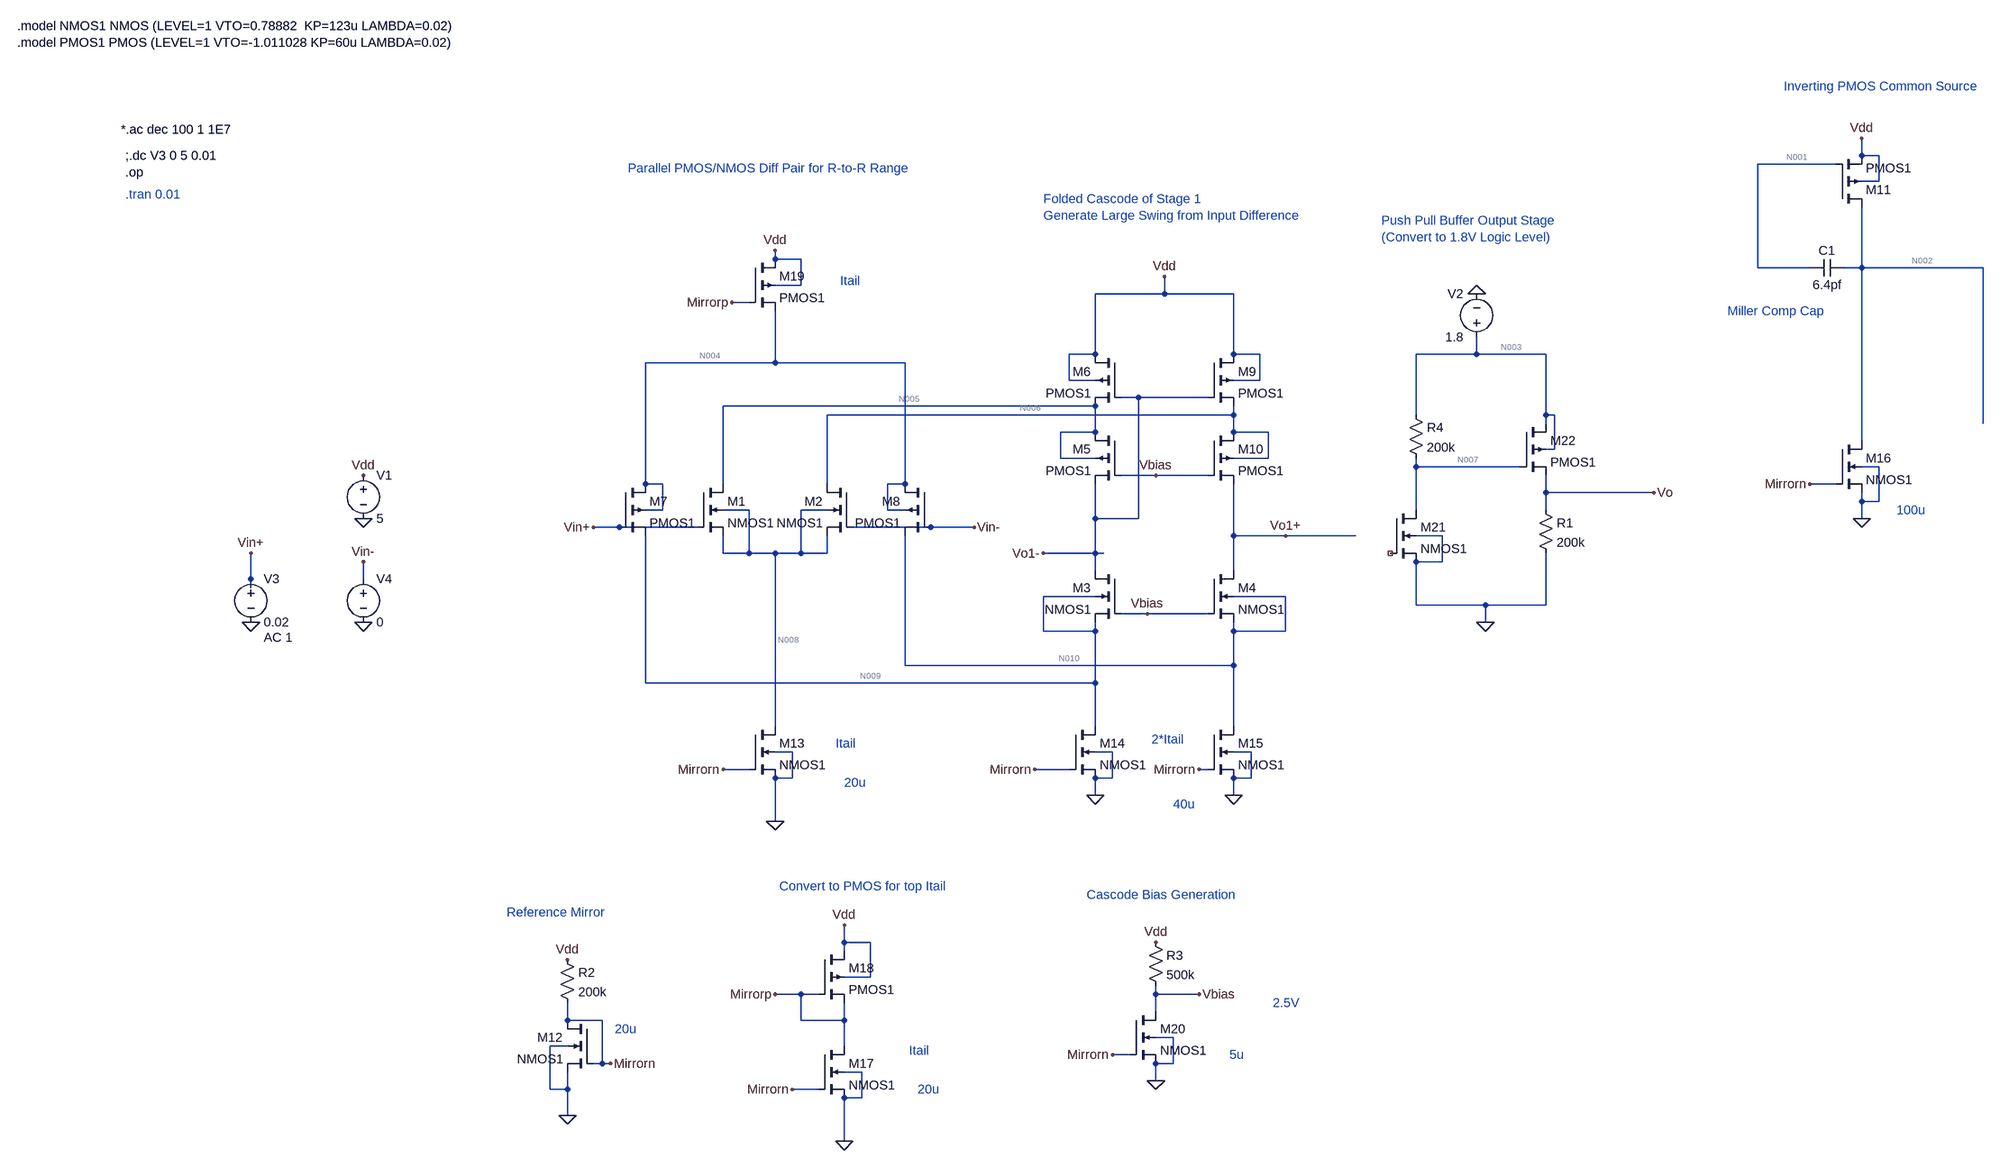
[diagram p0: schematic MOSFET_R2R_Input_Stage_CS_output_tuned_nolevelshift_WyattBuffer.asc]
MOSFET_R2R_Input_Stage_CS_output_tuned_nolevelshift_WyattBuffer.asc, the LTspice schematic file:
Version 4.1
SHEET 1 3376 1972
WIRE 3120 -32 3120 -64
WIRE 3152 -32 3120 -32
WIRE 3072 -16 2928 -16
WIRE 3152 16 3152 -32
WIRE 3152 16 3120 16
WIRE -96 160 -96 144
WIRE -48 160 -96 160
WIRE 2928 176 2928 -16
WIRE 3024 176 2928 176
WIRE 3120 176 3120 64
WIRE 3120 176 3088 176
WIRE 3344 176 3120 176
WIRE -48 208 -48 160
WIRE -48 208 -96 208
WIRE 624 224 624 192
WIRE 624 224 496 224
WIRE 752 224 624 224
WIRE -144 240 -176 240
WIRE 496 336 496 224
WIRE 496 336 448 336
WIRE 752 336 752 224
WIRE 800 336 752 336
WIRE 1328 336 1328 304
WIRE 1328 336 1216 336
WIRE 1456 336 1328 336
WIRE -96 352 -96 256
WIRE -96 352 -336 352
WIRE 144 352 -96 352
WIRE 448 384 448 336
WIRE 496 384 448 384
WIRE 800 384 800 336
WIRE 800 384 752 384
WIRE 576 416 544 416
WIRE 704 416 576 416
WIRE 496 432 -192 432
WIRE 752 448 752 432
WIRE 752 448 0 448
WIRE 1216 448 1216 336
WIRE 1456 448 1456 336
WIRE 1472 448 1456 448
WIRE 1456 464 1456 448
WIRE 3344 464 3344 176
WIRE 496 480 496 432
WIRE 496 480 432 480
WIRE 752 480 752 448
WIRE 816 480 752 480
WIRE 3120 496 3120 176
WIRE 1472 512 1472 448
WIRE 1472 512 1456 512
WIRE 432 528 432 480
WIRE 496 528 432 528
WIRE 816 528 816 480
WIRE 816 528 752 528
WIRE 1216 544 1216 528
WIRE 1408 544 1216 544
WIRE 3152 544 3120 544
WIRE 608 560 544 560
WIRE 704 560 608 560
WIRE -336 576 -336 352
WIRE -304 576 -336 576
WIRE -192 576 -192 432
WIRE 0 576 0 448
WIRE 144 576 144 352
WIRE 144 576 112 576
WIRE 3072 576 3024 576
WIRE 1456 592 1456 560
WIRE 1696 592 1456 592
WIRE 3120 608 3120 592
WIRE 3152 608 3152 544
WIRE 3152 608 3120 608
WIRE -304 624 -304 576
WIRE -304 624 -336 624
WIRE -144 624 -192 624
WIRE 0 624 -48 624
WIRE 112 624 112 576
WIRE 144 624 112 624
WIRE 1216 624 1216 544
WIRE 1456 624 1456 592
WIRE 496 640 496 576
WIRE 576 640 576 416
WIRE 576 640 496 640
WIRE 3120 640 3120 608
WIRE -384 656 -432 656
WIRE -240 656 -384 656
WIRE 192 656 48 656
WIRE 272 656 192 656
WIRE 752 672 752 576
WIRE 848 672 752 672
WIRE 1104 672 848 672
WIRE 1264 672 1216 672
WIRE -192 704 -192 672
WIRE -144 704 -144 624
WIRE -144 704 -192 704
WIRE -96 704 -144 704
WIRE -48 704 -48 624
WIRE -48 704 -96 704
WIRE 0 704 0 672
WIRE 0 704 -48 704
WIRE 496 704 496 640
WIRE 496 704 400 704
WIRE 512 704 496 704
WIRE 1264 720 1264 672
WIRE 1264 720 1216 720
WIRE 496 736 496 704
WIRE 752 736 752 672
WIRE -1152 752 -1152 704
WIRE -944 752 -944 720
WIRE -1152 768 -1152 752
WIRE 496 784 400 784
WIRE 848 784 752 784
WIRE 1216 800 1216 720
WIRE 1344 800 1216 800
WIRE 1456 800 1456 704
WIRE 1456 800 1344 800
WIRE 592 816 544 816
WIRE 704 816 592 816
WIRE 1344 832 1344 800
WIRE 400 848 400 784
WIRE 496 848 496 832
WIRE 496 848 400 848
WIRE 752 848 752 832
WIRE 848 848 848 784
WIRE 848 848 752 848
WIRE 144 912 144 672
WIRE 752 912 752 848
WIRE 752 912 144 912
WIRE -336 944 -336 672
WIRE 496 944 496 848
WIRE 496 944 -336 944
WIRE -96 1024 -96 704
WIRE 496 1024 496 944
WIRE 752 1024 752 912
WIRE -64 1072 -96 1072
WIRE 528 1072 496 1072
WIRE 784 1072 752 1072
WIRE -144 1104 -192 1104
WIRE 448 1104 384 1104
WIRE 704 1104 688 1104
WIRE -64 1120 -64 1072
WIRE -64 1120 -96 1120
WIRE 496 1120 496 1104
WIRE 528 1120 528 1072
WIRE 528 1120 496 1120
WIRE 784 1120 784 1072
WIRE 784 1120 752 1120
WIRE 496 1152 496 1120
WIRE 752 1152 752 1120
WIRE -96 1200 -96 1120
WIRE 32 1424 32 1392
WIRE 80 1424 32 1424
WIRE 32 1440 32 1424
WIRE 80 1488 80 1424
WIRE 80 1488 32 1488
WIRE -48 1520 -96 1520
WIRE -16 1520 -48 1520
WIRE 608 1520 608 1504
WIRE 688 1520 608 1520
WIRE 608 1552 608 1520
WIRE -480 1568 -480 1536
WIRE -416 1568 -480 1568
WIRE -48 1568 -48 1520
WIRE 32 1568 32 1536
WIRE 32 1568 -48 1568
WIRE 640 1600 608 1600
WIRE -480 1616 -512 1616
WIRE 32 1616 32 1568
WIRE 560 1632 528 1632
WIRE -416 1648 -416 1568
WIRE -416 1648 -432 1648
WIRE -400 1648 -416 1648
WIRE 640 1648 640 1600
WIRE 640 1648 608 1648
WIRE 64 1664 32 1664
WIRE 608 1680 608 1648
WIRE -512 1696 -512 1616
WIRE -480 1696 -480 1664
WIRE -480 1696 -512 1696
WIRE -16 1696 -64 1696
WIRE 64 1712 64 1664
WIRE 64 1712 32 1712
WIRE -480 1744 -480 1696
WIRE 32 1792 32 1712
FLAG 272 656 Vin-
FLAG -432 656 Vin+
FLAG -944 640 0
FLAG -944 560 Vdd
FLAG -96 144 Vdd
FLAG 496 1152 0
FLAG 752 1152 0
FLAG 624 192 Vdd
FLAG -1152 832 0
FLAG -944 832 0
FLAG -1152 704 Vin+
FLAG -944 720 Vin-
FLAG 3120 -64 Vdd
FLAG 3120 640 0
FLAG 848 672 Vo1+
FLAG 400 704 Vo1-
FLAG -480 1456 Vdd
FLAG -480 1744 0
FLAG -96 1200 0
FLAG -400 1648 Mirrorn
FLAG -192 1104 Mirrorn
FLAG 384 1104 Mirrorn
FLAG 688 1104 Mirrorn
FLAG 3024 576 Mirrorn
FLAG 32 1792 0
FLAG -64 1696 Mirrorn
FLAG 32 1392 Vdd
FLAG -96 1520 Mirrorp
FLAG -176 240 Mirrorp
FLAG 528 1632 Mirrorn
FLAG 608 1680 0
FLAG 608 1424 Vdd
FLAG 688 1520 Vbias
FLAG 592 816 Vbias
FLAG 608 560 Vbias
FLAG 1328 224 0
FLAG 1344 832 0
FLAG 1696 592 Vo
DATAFLAG 992 672 ""
DATAFLAG 416 944 ""
DATAFLAG 656 912 ""
DATAFLAG 512 704 ""
DATAFLAG -272 352 ""
DATAFLAG -96 816 ""
DATAFLAG 2944 -16 ""
DATAFLAG 3232 176 ""
DATAFLAG 1584 592 ""
DATAFLAG 1328 544 ""
DATAFLAG 752 1008 ""
SYMBOL nmos4 -240 576 R0
SYMATTR InstName M1
SYMATTR Value NMOS1
SYMATTR Value2 l=0.5u w=0.5u
SYMBOL nmos4 48 576 M0
SYMATTR InstName M2
SYMATTR Value NMOS1
SYMATTR Value2 l=0.5u w=0.5u
SYMBOL pmos4 -384 576 R0
SYMATTR InstName M7
SYMATTR Value PMOS1
SYMATTR Value2 l=0.5u w=1u
SYMBOL pmos4 192 576 M0
SYMATTR InstName M8
SYMATTR Value PMOS1
SYMATTR Value2 l=0.5u w=1u
SYMBOL voltage -944 544 R0
WINDOW 123 0 0 Left 0
WINDOW 39 0 0 Left 0
SYMATTR InstName V1
SYMATTR Value 5
SYMBOL nmos4 544 736 M0
SYMATTR InstName M3
SYMATTR Value NMOS1
SYMATTR Value2 l=0.5u w=0.5u
SYMBOL nmos4 704 736 R0
SYMATTR InstName M4
SYMATTR Value NMOS1
SYMATTR Value2 l=0.5u w=0.5u
SYMBOL pmos4 544 480 M0
SYMATTR InstName M5
SYMATTR Value PMOS1
SYMATTR Value2 l=0.5u w=1u
SYMBOL pmos4 544 336 M0
SYMATTR InstName M6
SYMATTR Value PMOS1
SYMATTR Value2 l=0.5u w=2u
SYMBOL pmos4 704 336 R0
SYMATTR InstName M9
SYMATTR Value PMOS1
SYMATTR Value2 l=0.5u w=2u
SYMBOL pmos4 704 480 R0
SYMATTR InstName M10
SYMATTR Value PMOS1
SYMATTR Value2 l=0.5u w=1u
SYMBOL voltage -1152 736 R0
WINDOW 123 24 124 Left 2
WINDOW 39 0 0 Left 0
SYMATTR Value2 AC 1
SYMATTR InstName V3
SYMATTR Value 0.02
SYMBOL voltage -944 736 R0
WINDOW 123 0 0 Left 0
WINDOW 39 0 0 Left 0
SYMATTR InstName V4
SYMATTR Value 0
SYMBOL cap 3088 160 R90
WINDOW 0 0 32 VBottom 2
WINDOW 3 32 32 VTop 2
SYMATTR InstName C1
SYMATTR Value 6.4pf
SYMBOL pmos4 3072 64 M180
SYMATTR InstName M11
SYMATTR Value PMOS1
SYMATTR Value2 l=0.5u w=5u
SYMBOL res -496 1440 R0
SYMATTR InstName R2
SYMATTR Value 200k
SYMBOL nmos4 -432 1568 M0
SYMATTR InstName M12
SYMATTR Value NMOS1
SYMATTR Value2 l=0.5u w=4u
SYMBOL nmos4 -144 1024 R0
SYMATTR InstName M13
SYMATTR Value NMOS1
SYMATTR Value2 l=0.5u w=4u
SYMBOL nmos4 448 1024 R0
SYMATTR InstName M14
SYMATTR Value NMOS1
SYMATTR Value2 l=0.5u w=8u
SYMBOL nmos4 704 1024 R0
SYMATTR InstName M15
SYMATTR Value NMOS1
SYMATTR Value2 l=0.5u w=8u
SYMBOL nmos4 3072 496 R0
SYMATTR InstName M16
SYMATTR Value NMOS1
SYMATTR Value2 l=0.5u w=20u
SYMBOL nmos4 -16 1616 R0
SYMATTR InstName M17
SYMATTR Value NMOS1
SYMATTR Value2 l=0.5u w=4u
SYMBOL pmos4 -16 1440 R0
SYMATTR InstName M18
SYMATTR Value PMOS1
SYMATTR Value2 l=0.5u w=4u
SYMBOL pmos4 -144 160 R0
SYMATTR InstName M19
SYMATTR Value PMOS1
SYMATTR Value2 l=0.5u w=4u
SYMBOL nmos4 560 1552 R0
SYMATTR InstName M20
SYMATTR Value NMOS1
SYMATTR Value2 l=0.5u w=1u
SYMBOL res 592 1408 R0
SYMATTR InstName R3
SYMATTR Value 500k
SYMBOL nmos4 1168 624 R0
SYMATTR InstName M21
SYMATTR Value NMOS1
SYMATTR Value2 l=0.5u w=2.5u
SYMBOL pmos4 1408 464 R0
SYMATTR InstName M22
SYMATTR Value PMOS1
SYMATTR Value2 l=0.5u w=5u
SYMBOL res 1440 608 R0
SYMATTR InstName R1
SYMATTR Value 200k
SYMBOL res 1200 432 R0
SYMATTR InstName R4
SYMATTR Value 200k
SYMBOL voltage 1328 320 R180
WINDOW 0 24 96 Left 2
WINDOW 3 24 16 Left 2
WINDOW 123 0 0 Left 0
WINDOW 39 0 0 Left 0
SYMATTR InstName V2
SYMATTR Value 1.8
TEXT 24 200 Left 2 ;Itail
TEXT 16 1056 Left 2 ;Itail
TEXT 600 1048 Left 2 ;2*Itail
TEXT -1584 -272 Left 2 !.model NMOS1 NMOS (LEVEL=1 VTO=0.78882  KP=123u LAMBDA=0.02)\n.model PMOS1 PMOS (LEVEL=1 VTO=-1.011028 KP=60u LAMBDA=0.02)
TEXT -1384 -32 Left 2 !;.dc V3 0 5 0.01\n.op
TEXT 2976 -160 Left 2 ;Inverting PMOS Common Source
TEXT 2872 256 Left 2 ;Miller Comp Cap
TEXT -368 -8 Left 2 ;Parallel PMOS/NMOS Diff Pair for R-to-R Range
TEXT -392 1584 Left 2 ;20u
TEXT 32 1128 Left 2 ;20u
TEXT 640 1168 Left 2 ;40u
TEXT 3184 624 Left 2 ;100u
TEXT 152 1624 Left 2 ;Itail
TEXT 168 1696 Left 2 ;20u
TEXT -592 1368 Left 2 ;Reference Mirror
TEXT -88 1320 Left 2 ;Convert to PMOS for top Itail
TEXT 744 1632 Left 2 ;5u
TEXT 480 1336 Left 2 ;Cascode Bias Generation
TEXT -1392 -80 Left 2 !*.ac dec 100 1 1E7
TEXT -1384 40 Left 2 ;.tran 0.01
TEXT 824 1536 Left 2 ;2.5V
TEXT 400 48 Left 2 ;Folded Cascode of Stage 1\nGenerate Large Swing from Input Difference
TEXT 1152 88 Left 2 ;Push Pull Buffer Output Stage\n(Convert to 1.8V Logic Level)

The netlist it stands for:
* MOSFET_R2R_Input_Stage_CS_output_tuned_nolevelshift_WyattBuffer.asc
M1 N005 Vin+ N008 N008 NMOS1 l=0.5u w=0.5u
M2 N006 Vin- N008 N008 NMOS1 l=0.5u w=0.5u
M7 N004 Vin+ N009 N004 PMOS1 l=0.5u w=1u
M8 N004 Vin- N010 N004 PMOS1 l=0.5u w=1u
V1 Vdd 0 5
M3 Vo1- Vbias N009 N009 NMOS1 l=0.5u w=0.5u
M4 Vo1+ Vbias N010 N010 NMOS1 l=0.5u w=0.5u
M5 N005 Vbias Vo1- N005 PMOS1 l=0.5u w=1u
M6 Vdd Vo1- N005 Vdd PMOS1 l=0.5u w=2u
M9 Vdd Vo1- N006 Vdd PMOS1 l=0.5u w=2u
M10 N006 Vbias Vo1+ N006 PMOS1 l=0.5u w=1u
V3 Vin+ 0 0.02 AC 1
V4 Vin- 0 0
C1 N002 N001 6.4pf
M11 N002 N001 Vdd Vdd PMOS1 l=0.5u w=5u
R2 Vdd Mirrorn 200k
M12 Mirrorn Mirrorn 0 0 NMOS1 l=0.5u w=4u
M13 N008 Mirrorn 0 0 NMOS1 l=0.5u w=4u
M14 N009 Mirrorn 0 0 NMOS1 l=0.5u w=8u
M15 N010 Mirrorn 0 0 NMOS1 l=0.5u w=8u
M16 N002 Mirrorn 0 0 NMOS1 l=0.5u w=20u
M17 Mirrorp Mirrorn 0 0 NMOS1 l=0.5u w=4u
M18 Vdd Mirrorp Mirrorp Vdd PMOS1 l=0.5u w=4u
M19 Vdd Mirrorp N004 Vdd PMOS1 l=0.5u w=4u
M20 Vbias Mirrorn 0 0 NMOS1 l=0.5u w=1u
R3 Vdd Vbias 500k
M21 N007 NC_01 0 0 NMOS1 l=0.5u w=2.5u
M22 N003 N007 Vo N003 PMOS1 l=0.5u w=5u
R1 Vo 0 200k
R4 N003 N007 200k
V2 N003 0 1.8
.model NMOS NMOS
.model PMOS PMOS
.lib standard.mos
* Itail
* Itail
* 2*Itail
.model NMOS1 NMOS (LEVEL=1 VTO=0.78882  KP=123u LAMBDA=0.02)
.model PMOS1 PMOS (LEVEL=1 VTO=-1.011028 KP=60u LAMBDA=0.02)
;.dc V3 0 5 0.01
.op
* Inverting PMOS Common Source
* Miller Comp Cap
* Parallel PMOS/NMOS Diff Pair for R-to-R Range
* 20u
* 20u
* 40u
* 100u
* Itail
* 20u
* Reference Mirror
* Convert to PMOS for top Itail
* 5u
* Cascode Bias Generation
*.ac dec 100 1 1E7
* .tran 0.01
* 2.5V
* Folded Cascode of Stage 1
* Generate Large Swing from Input Difference
* Push Pull Buffer Output Stage
* (Convert to 1.8V Logic Level)
.backanno
.end

* Results of the author's LTspice run, read from the files saved beside the schematic
* Operating Point:
*   V(mirrorn) = 988.8 mV
*   V(mirrorp) = 3.696 V
*   V(n001) = 31.71 pV
*   V(n002) = 4.955 V
*   V(n003) = 1.8 V
*   V(n004) = 1.447 V
*   V(n005) = 4.134 V
*   V(n006) = 4.587 V
*   V(n007) = 1.8 V
*   V(n008) = 88.76 nV
*   V(n009) = 957.1 mV
*   V(n010) = 974.1 mV
*   V(vbias) = 2.422 V
*   V(vdd) = 5 V
*   V(vin+) = 20 mV
*   V(vin-) = 0 V
*   V(vo) = 722 nV
*   V(vo1+) = 4.359 V
*   V(vo1-) = 3.497 V
*   I(C1) = 0 A
*   I(R1) = 3.61 pA
*   I(R2) = 20.06 µA
*   I(R3) = 5.155 µA
*   I(R4) = 3.61 pA
*   I(V1) = -234.6 µA
*   I(V2) = -7.22 pA
*   I(V3) = 0 A
*   I(V4) = 0 A
*   Ib(M1) = -4.144 pA
*   Ib(M10) = 238 fA
*   Ib(M11) = 53.65 fA
*   Ib(M12) = -998.8 fA
*   Ib(M13) = 0 A
*   Ib(M14) = -967.1 fA
*   Ib(M15) = -984.1 fA
*   Ib(M16) = -4.965 pA
*   Ib(M17) = -3.706 pA
*   Ib(M18) = 1.314 pA
*   Ib(M19) = 3.563 pA
*   Ib(M2) = -4.597 pA
*   Ib(M20) = -2.432 pA
*   Ib(M21) = -1.81 pA
*   Ib(M22) = 1.81 pA
*   Ib(M3) = -2.55 pA
*   Ib(M4) = -3.395 pA
*   Ib(M5) = 647.3 fA
*   Ib(M6) = 875.9 fA
*   Ib(M7) = 500.4 fA
*   Ib(M8) = 483.4 fA
*   Ib(M9) = 423.3 fA
*   Id(M1) = 8.278 pA
*   Id(M10) = 28.56 µA
*   Id(M11) = -108.1 µA
*   Id(M12) = 20.06 µA
*   Id(M13) = 17.46 pA
*   Id(M14) = 40.09 µA
*   Id(M15) = 40.1 µA
*   Id(M16) = 108.1 µA
*   Id(M17) = 21.12 µA
*   Id(M18) = 21.12 µA
*   Id(M19) = 22.05 µA
*   Id(M2) = 9.183 pA
*   Id(M20) = 5.155 µA
*   Id(M21) = 3.61 pA
*   Id(M22) = 1.8 pA
*   Id(M3) = 29.58 µA
*   Id(M4) = 28.56 µA
*   Id(M5) = 29.58 µA
*   Id(M6) = 29.58 µA
*   Id(M7) = 10.51 µA
*   Id(M8) = 11.54 µA
*   Id(M9) = 28.56 µA
*   Ig(M1) = 0 A
*   Ig(M10) = 0 A
*   Ig(M11) = 0 A
*   Ig(M12) = 0 A
*   Ig(M13) = 0 A
*   Ig(M14) = 0 A
*   Ig(M15) = 0 A
*   Ig(M16) = 0 A
*   Ig(M17) = 0 A
*   Ig(M18) = 0 A
*   Ig(M19) = 0 A
*   Ig(M2) = 0 A
*   Ig(M20) = 0 A
*   Ig(M21) = 0 A
*   Ig(M22) = 0 A
*   Ig(M3) = 0 A
*   Ig(M4) = 0 A
*   Ig(M5) = 0 A
*   Ig(M6) = 0 A
*   Ig(M7) = 0 A
*   Ig(M8) = 0 A
*   Ig(M9) = 0 A
*   Is(M1) = -4.134 pA
*   Is(M10) = -28.56 µA
*   Is(M11) = 108.1 µA
*   Is(M12) = -20.06 µA
*   Is(M13) = -17.46 pA
*   Is(M14) = -40.09 µA
*   Is(M15) = -40.1 µA
*   Is(M16) = -108.1 µA
*   Is(M17) = -21.12 µA
*   Is(M18) = -21.12 µA
*   Is(M19) = -22.05 µA
*   Is(M2) = -4.587 pA
*   Is(M20) = -5.155 µA
*   Is(M21) = -1.8 pA
*   Is(M22) = -3.61 pA
*   Is(M3) = -29.58 µA
*   Is(M4) = -28.56 µA
*   Is(M5) = -29.58 µA
*   Is(M6) = -29.58 µA
*   Is(M7) = -10.51 µA
*   Is(M8) = -11.54 µA
*   Is(M9) = -28.56 µA